# Altium schematic sheet PWR_P6V0.SchDoc: Fast Servo
size 297 x 209 mm; Organization: Altium Limited; Address1: L3, 12a Rodborough Rd; Address2: Frenchs Forest; Address3: NSW; Address4: Australia 2086; DocumentNumber: 23; SheetNumber: 23; SheetTotal: 28; Title2: Power +5 V
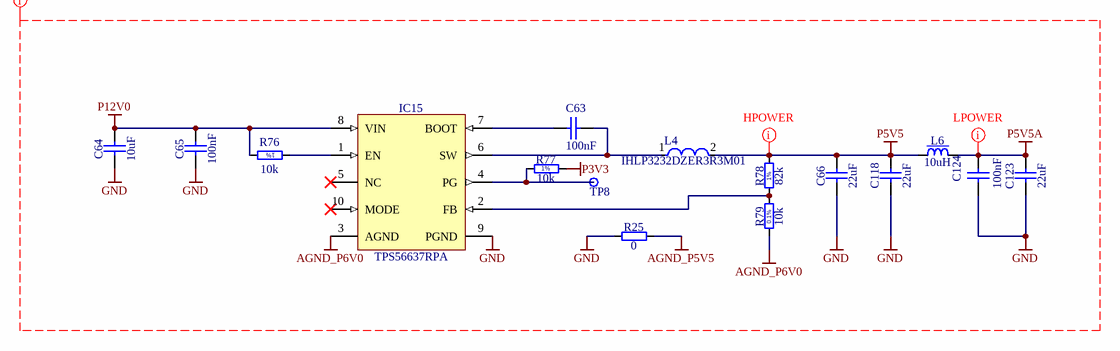
[diagram p0: PWR_P6V0.SchDoc]

## Parts
C63  100nF  [CAPC1005X55N]
C64  10uF  [CAPC2012X95N]
C65  100nF  [CAPC1005X55N]
C66  22uF  [CAPC2012X135N]
C118  22uF  [CAPC2012X135N]
C123  22uF  [CAPC2012X135N]
C124  100nF  [CAPC1005X55N]
IC15  TPS56637RPA  [TEXAS_RPA0010A]
L4  IHLP3232DZER3R3M01  [FP-IHLP-3232DZ-FP_2_413x5-MFG]
L6  10uH  [IND_MURATA-PS_8400]
R25  0  [RESC1005X40N]
R76  10k  [RESC1005X40N]
R77  10k  [RESC1005X40N]
R78  82k  [RESC1608X55N]
R79  10k  [RESC1608X55N]
TP8  Test Point  [TPS127]  (value not drawn)

## Nets
AGND_P5V5: R25.2
AGND_P6V0: IC15.3(AGND) R79.1
GND: C64.1 C65.1 C66.1 C118.1 C123.1 C124.1 IC15.9(PGND) R25.1
P3V3: R77.2
P5V5: C66.2 C118.2 L4.2 L6.1 R78.2
P5V5A: C123.2 C124.2 L6.2
P12V0: C64.2 C65.2 IC15.8(VIN) R76.2
NetC63_1: C63.1 IC15.6(SW) L4.1
NetC63_2: C63.2 IC15.7(BOOT)
NetIC15_1: IC15.1(EN) R76.1
NetIC15_2: IC15.2(FB) R78.1 R79.2
NetIC15_4: IC15.4(PG) R77.1 TP8.1

Not connected (* = marked no-connect by the designer): IC15 5(NC)* 10(MODE)*

## Layout directives
net class Lpower; rule Routing Via Style [Pref Size = 0.6mm    Pref Hole Size = 0.3mm]; rule Width Constraint [Pref Width = 15mil    Min Width = 10mil    Max Width = 20mil]: P5V5, P5V5A
net class P6V0; rule Polygon Connect Style [Style - Direct Connect]; rule Clearance Constraint [Generic clearance = 5mil, and 9 value(s) for objects]: AGND_P5V5, AGND_P6V0, GND, P3V3, P5V5, P5V5A, P12V0

## Notes on the sheet
- Project
- Document
- Designer
- Drawn by
- Check.by
- File
- Last Mod.
- Print Date
- Sheet
- Size
- A4
- of
- Rev
- (in symbol R0402_10K_1%_0.0625W_100PPM) 1%
- (in symbol R0603_10K_0.1%_0.063W_10PPM) 0.1%
- (in symbol R0603_82K_1%_0.1W_100PPM) 1%

## Library data of the parts
C63 C65 C124 = CC0402_100NF_16V_10%_X5R: Non-polarised capacitor; Part Description: SMD Multilayer Chip Ceramic Capacitor; Manufacturer: GENERIC; Manufacturer1 Part Number: GRM155R61C104KA88D; Voltage: 16V; TC: X5R; Tolerance: ±10%; Part Number: CC0402_100NF_16V_10%_X5R; Component Kind: Standard; Component Type: Standard; Pin Count: 2; Value: 100nF; Status: None; Manufacturer Part Number: CC0402_100NF_16V_10%_X5R; Case: 0402; Mounted: Yes; Socket: No; SMD: Yes; Sense: No; Manufacturer1 Example: MURATA; Manufacturer1 ComponentHeight: 0.55mm; HelpURL: \\cern.ch\dfs\Applications\Altium\Datasheets\CC0402_X5R_MURATA_GRM.pdf; Author: CERN DEM JLC; CreateDate: 10.12.2013; LatestRevisionDate: 10.12.2013
C64 = CC0805_10UF_25V_10%_X5R: Non-polarised capacitor; Part Description: SMD Multilayer Chip Ceramic Capacitor; Manufacturer: GENERIC; Manufacturer1 Part Number: GRM219R61E106KA12D; Voltage: 25V; TC: X5R; Tolerance: ±10%; Part Number: CC0805_10UF_25V_10%_X5R; Component Kind: Standard; Component Type: Standard; Pin Count: 2; Value: 10uF; Status: Preferred; Manufacturer Part Number: CC0805_10UF_25V_10%_X5R; Case: 0805; Mounted: Yes; Socket: No; SMD: Yes; Sense: No; Manufacturer1 Example: MURATA; Manufacturer1 ComponentHeight: 0.95mm; HelpURL: \\cern.ch\dfs\Applications\Altium\Datasheets\CC0805_X5R_MURATA_GRM.pdf; Author: CERN DEM JLC; CreateDate: 25-Oct-12; LatestRevisionDate: 06-Sep-16
C66 C118 C123 = CC0805_22UF_16V_10%_X5R: Non-polarised capacitor; Part Description: SMD Multilayer Chip Ceramic Capacitor; Manufacturer: GENERIC; Manufacturer1 Part Number: C2012X5R1C226KT; Voltage: 16V; TC: X5R; Tolerance: ±10%; Part Number: CC0805_22UF_16V_10%_X5R; Component Kind: Standard; Component Type: Standard; Pin Count: 2; Value: 22uF; Status: Preferred; Manufacturer Part Number: CC0805_22UF_16V_10%_X5R; Case: 0805; Mounted: Yes; Socket: No; SMD: Yes; Sense: No; Manufacturer1 Example: TDK; Manufacturer1 ComponentHeight: 1.35mm; HelpURL: \\cern.ch\dfs\Applications\Altium\Datasheets\CC0805_X5R_TDK_C.pdf; Author: CERN DEM JLC
  C66 C118: CreateDate: 25-Oct-12; LatestRevisionDate: 25-Oct-12
  C123: CreateDate: 25.10.2012; LatestRevisionDate: 25.10.2012
IC15 = TPS56637RPA: 4.5V to 28V Input, 6A Synchronous Buck Converter; Manufacturer: TEXAS INSTRUMENTS; PressFit: No; Bonding: No; Part Number: TPS56637RPA; Component Kind: Standard; Component Type: Standard; Device: TPS56637RPA; PackageDescription: TEXAS Case Style RPA0010A, QFN, 0.50mm Pitch; 10 Pin, 3.00mm W X3.00mm L X 1.00mm H body; Part Description: 4.5V to 28V Input, 6A Synchronous Buck Converter; Manufacturer Part Number: TPS56637RPA; Pin Count: 10; Mounted: Yes; Socket: No; SMD: Yes; Sense: No; ComponentHeight: 1mm; HelpURL: \\cern.ch\dfs\Applications\Altium\Datasheets\TPS56637RPA.pdf; Author: CERN DEM BC; CreateDate: 06/07/2020; LatestRevisionDate: 06/07/2020
L4 = CMP-02424-000021-1: Commercial Inductors, Low DCR Series 3.3uH 9.2 A 17.7mΩ 20%; Self Resonant Frequency: 17MHz; Test Frequency: 100kHz; Current Rating: 8A; Core Material: Ferrite; Saturation Current: 8.7A; DC Resistance (DCR): 22.6mR; Inductance: 4.7uH; Shielding: Shielded; Packaging: Tape and Reel; RMS Current (Irms): 8A; Min Operating Temperature: -55°C; Tolerance: 20%; Contact Plating: Tin; Width: 8.18mm; Number of Pins: 2; Inductance Tolerance: 20%; Height: 4mm; Mount: Surface Mount; Package Quantity: 500; Lead Free: Lead Free; Max DC Current: 8A; Case/Package: 3232; Military Standard: Not; Max Operating Temperature: 125°C; Depth: 8.26mm; Length: 8.89mm; Termination: SMD/SMT; Height - Seated (Max): 0.157inch; Radiation Hardening: No
L6 = IND_10UH_10%_MURATA-PS_8400: Inductor With Core; Part Description: Miniature Surface Mount Power Inductor (8400 Serie); Manufacturer: MURATA POWER SOLUTIONS; Manufacturer Part Number: 84103C; Power: 950mA; Resistance: 0.24R; Tolerance: ±10%; Part Number: IND_10UH_10%_MURATA-PS_8400; Component Kind: Standard; Component Type: Standard; Pin Count: 2; Value: 10uH; Status: None; Mounted: Yes; Socket: No; SMD: Yes; Sense: No; ComponentHeight: 2.9mm; HelpURL: \\cern.ch\dfs\Applications\Altium\Datasheets\IND_MURATA-PS_8400.pdf; Author: CERN DEM JLC; CreateDate: 02.07.2012; LatestRevisionDate: 02.07.2012
R25 = R0402_0R_JUMPER: Resistor; Part Description: 1A (0.05R Max DC Resistance) Zero Ohm Jumper; Manufacturer: GENERIC; Manufacturer1 Part Number: 232270591001L; PressFit: No; Part Number: R0402_0R_JUMPER; Component Kind: Standard; Component Type: Standard; Pin Count: 2; Value: 0; Status: Not Recommended; Manufacturer Part Number: R0402_0R_JUMPER; Case: 0402; Mounted: Yes; Sense: No; Socket: No; SMD: Yes; Manufacturer1 Example: YAGEO PHYCOMP; Manufacturer1 ComponentHeight: 0.4mm; HelpURL: \\cern.ch\dfs\Applications\Altium\Datasheets\R0402_Phycomp_RC0402.pdf; Author: CERN DEM JLC; CreateDate: 03/12/2007; LatestRevisionDate: 17/10/2012
R76 R77 = R0402_10K_1%_0.0625W_100PPM: Resistor - 1%; Part Description: General Purpose Thick Film Chip Resistor; Manufacturer: GENERIC; Manufacturer1 Part Number: 232270671003L; PressFit: No; TC: ±100ppm/°C; Part Number: R0402_10K_1%_0.0625W_100PPM; Component Kind: Standard; Component Type: Standard; Pin Count: 2; Value: 10k; Status: Not Recommended; Manufacturer Part Number: R0402_10K_1%_0.0625W_100PPM; Case: 0402; Mounted: Yes; Sense: No; Socket: No; SMD: Yes; Manufacturer1 Example: YAGEO PHYCOMP; Manufacturer1 ComponentHeight: 0.4mm; HelpURL: \\cern.ch\dfs\Applications\Altium\Datasheets\R0402_Phycomp_RC0402.pdf; Author: CERN DEM JLC; CreateDate: 03-Dec-07; LatestRevisionDate: 17-Oct-12; Power: 0.0625W; Tolerance: ±1%
R78 = R0603_82K_1%_0.1W_100PPM: Resistor - 1%; Part Description: General Purpose Thick Film Chip Resistor; Manufacturer: GENERIC; Manufacturer1 Part Number: NRC06F8202TRF; PressFit: No; Power: 0.1W; TC: ±100ppm/°C; Part Number: R0603_82K_1%_0.1W_100PPM; Component Kind: Standard; Component Type: Standard; Pin Count: 2; Value: 82k; Status: Preferred; Manufacturer Part Number: R0603_82K_1%_0.1W_100PPM; Case: 0603; Mounted: Yes; Sense: No; Socket: No; SMD: Yes; Manufacturer1 Example: NIC COMPONENT; Manufacturer1 ComponentHeight: 0.55mm; HelpURL: \\cern.ch\dfs\Applications\Altium\Datasheets\R0603_NIC_NRC.pdf; Author: CERN DEM JLC; CreateDate: 03/12/2007; LatestRevisionDate: 13/03/2008; Tolerance: ±1%
R79 = R0603_10K_0.1%_0.063W_10PPM: Resistor - 0.1%; Part Description: Thin Film Chip Resistor; Manufacturer: GENERIC; Manufacturer1 Part Number: RN73C1J10KBTDF; PressFit: No; Power: 0.063W; TC: ±10ppm; Part Number: R0603_10K_0.1%_0.063W_10PPM; Component Kind: Standard; Component Type: Standard; Pin Count: 2; Value: 10k; Status: Not Recommended; Manufacturer Part Number: R0603_10K_0.1%_0.063W_10PPM; Case: 0603; Mounted: Yes; Sense: No; Socket: No; SMD: Yes; Manufacturer1 Example: TYCO HOLSWORTHY; Manufacturer1 ComponentHeight: 0.5mm; HelpURL: \\cern.ch\dfs\Applications\Altium\Datasheets\R0603_Tyco_RN73.pdf; Author: CERN DEM JLC; CreateDate: 03-Dec-07; LatestRevisionDate: 13-Mar-08; Tolerance: ±0.1%
TP8 = SMD_PAD_1.27X1.27MM: Part Description: 1.27mm x 1.27mm PCB Copper Area (SMD Test Point); Mounted: No; Part Number: SMD_PAD_1.27X1.27MM; Component Kind: Standard (No BOM); Component Type: Standard (No BOM); Pin Count: 1; Family: Test Point; Socket: No; SMD: Yes; Sense: No; Status: None; ComponentHeight: 0mm; HelpURL: Undefined; Author: CERN DEM JLC; CreateDate: 12.01.2008; LatestRevisionDate: 12.01.2008; PackageDescription: 1.27mm x 1.27mm PCB Copper Area (SMD Test Point)